# Altium schematic sheet mcu_support.SchDoc
size A3; SheetNumber: 4; SheetTotal: 5
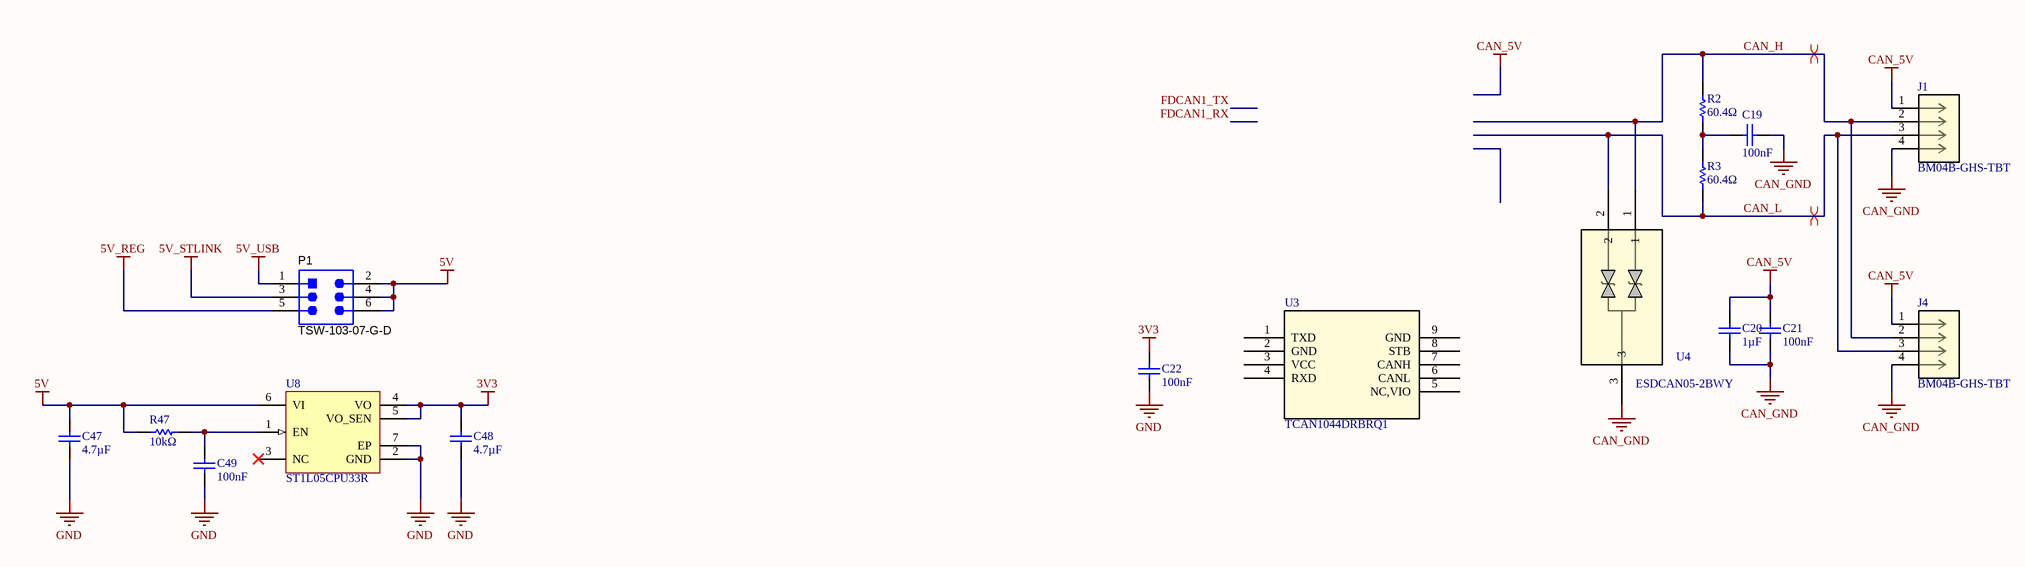
[diagram p0: mcu_support.SchDoc]

## Parts
C19  value 100nF  [C0603]  (hidden comment: CC0603KRX7R8BB104)
C20  value 1µF  [C0603]  (hidden comment: CC0603KRX7R7BB105)
C21  value 100nF  [C0603]  (hidden comment: CC0603KRX7R8BB104)
C22  value 100nF  [C0603]  (hidden comment: CC0603KRX7R8BB104)
C47  value 4.7µF  [C0603]  (hidden comment: CC0603KRX5R7BB475)
C48  value 4.7µF  [C0603]  (hidden comment: CC0603KRX5R7BB475)
C49  value 100nF  [C0603]  (hidden comment: CC0603KRX7R8BB104)
J1  BM04B-GHS-TBT  [CONN_BM04B-GHS-TBT_JST]
J4  BM04B-GHS-TBT  [CONN_BM04B-GHS-TBT_JST]
P1  TSW-103-07-G-D  [SMTC-TSW-103-07-G-D_V]
R2  value 60.4Ω  [RESC1608X55X25ML10T15]  (hidden comment: RC0603FR-0760R4L)
R3  value 60.4Ω  [RESC1608X55X25ML10T15]  (hidden comment: RC0603FR-0760R4L)
R47  value 10kΩ  [RESC1608X55X25ML10T15]  (hidden comment: RC0603FR-0710KL)
U3  TCAN1044DRBRQ1  [SON_4DRBRQ1_TEX]
U4  ESDCAN05-2BWY  [SOT323-3L_STM]
U8  ST1L05CPU33R  [DFN6D_L]

## Nets
3V3: C22.2 C48.2 U8.4(VO) U8.5(VO_SEN)
5V: C47.2 P1.2 P1.4 P1.6 R47.1 U8.6(VI)
5V_REG: P1.5
5V_STLINK: P1.3
5V_USB: P1.1
CAN_5V: C20.2 C21.2 J1.1 J4.1
CAN_GND: C19.1 C20.1 C21.1 J1.4 J4.4 U4.3
GND: C22.1 C47.1 C48.1 C49.1 U8.2(GND) U8.7(EP)
CAN_H: J1.2 J4.2 R2.2 U4.1
CAN_L: J1.3 J4.3 R3.1 U4.2
NetC19_2: C19.2 R2.1 R3.2
NetC49_2: C49.2 R47.2 U8.1(EN)

Not connected (* = marked no-connect by the designer): U3 1(TXD) 2(GND) 3(VCC) 4(RXD) 5(NC,VIO) 6(CANL) 7(CANH) 8(STB) 9(GND); U8 3(NC)*

## Layout directives
differential pair: CAN_H, CAN_L

## Library data of the parts
C19 C21 C22 C49 = CMP-00179-1: 25V 100nF X7R ±10% 0603 Multilayer Ceramic Capacitors MLCC - SMD/SMT ROHS; Length: 1.6mm; Pins: 2; Case/Package: 0603; Composition: Ceramic; Lead Free: Lead Free; Lifecycle Status: Production; RoHS: Compliant; China RoHS: Compliant; Number of Terminals: 2; Max Operating Temperature: 125°C; Tolerance: 10%; Width: 800µm; Dielectric Material: Ceramic; Voltage Rating (DC): 25V; Depth: 800µm; Min Operating Temperature: -55°C; Halogen Free: Halogen Free; Mounting Technology: Surface Mount; Material: Ceramic; REACH SVHC: Yes; Case Code (Imperial): 0603; Height: 800µm; Schedule B: 8532240020, 8532240020; Voltage Rating: 25V; Thickness: 889µm; Termination: SMD/SMT; Dielectric: X7R; Radiation Hardening: No; Voltage: 25V; Case Code (Metric): 1608
C20 = CMP-00211-1: 16V 1uF X7R ±10% 0603 Multilayer Ceramic Capacitors MLCC - SMD/SMT ROHS; Dissipation Factor: 5%; Harmonized Tariff Schedule (HTS) Code: 8532.24.00.20; Width: 800µm; Country of Origin: Mainland China, Taiwan; Case Code (Imperial): 0603; Schedule B: 8532240020, 8532240020; Halogen Free: Halogen Free; Lifecycle Status: Production; China RoHS: Compliant; Max Operating Temperature: 125°C; Export Control Classification Number (ECCN) Code: EAR99; Min Operating Temperature: -55°C; Radiation Hardening: No; Dielectric Material: Ceramic; Voltage: 16V; RoHS: Compliant; Voltage Rating (DC): 16V; Termination: SMD/SMT; Material: Ceramic; Mounting Technology: Surface Mount; Case Code (Metric): 1608; Case/Package: 0603; Depth: 800µm; Voltage Rating: 16V; Dielectric: X7R; Thickness: 889µm; Lead Free: Lead Free; Length: 1.6mm; REACH SVHC: Yes; Height: 800µm; Introduction Date: 2009-04-17; Tolerance: 10%; Composition: Ceramic; Number of Terminals: 2; Pins: 2
C47 C48 = CMP-00273-1: 16V 4.7uF X5R ±10% 0603 Multilayer Ceramic Capacitors MLCC - SMD/SMT ROHS; Halogen Free: Halogen Free; Depth: 800µm; Case/Package: 0603; China RoHS: Compliant; REACH SVHC: Yes; Height: 800µm; Harmonized Tariff Schedule (HTS) Code: 8532.24.00.20; Width: 800µm; Export Control Classification Number (ECCN) Code: EAR99; Voltage Rating (DC): 16V; Number of Terminals: 2; Country of Origin: Mainland China, Taiwan; Thickness: 939.8µm; Material: Ceramic; Introduction Date: 2013-02-05; RoHS: Compliant; Dielectric: X5R; Voltage Rating: 16V; Max Operating Temperature: 85°C; Case Code (Imperial): 0603; Mounting Technology: Surface Mount; Composition: Ceramic; Min Operating Temperature: -55°C; Length: 1.6mm; Tolerance: 10%; Lead Free: Lead Free; Lifecycle Status: Production; Schedule B: 8532240020, 8532240020; Dielectric Material: Ceramic; Termination: SMD/SMT; Case Code (Metric): 1608; Weight: 2.012816mg
J1 J4 = CMP-189-000000-2: Description; Manufacturer_Name: JST; Source: BM04B-GHS-TBT.SchLib; Copyright: Copyright (C) 2026 Ultra Librarian. All rights reserved.; Design Item ID: BM04B-GHS-TBT; Type: Type; Manufacturer_Part_Number: BM04B-GHS-TBT; RefDes: RefDes
P1 = CMP-014-000047-1: CONN HEADER VERT 6POS 2.54MM / Connector Header Through Hole 6 position 0.100" (2.54mm); Manufacturer Lifecycle Status: PRODUCTION; Max Voltage Rating (AC): 550V; Number of Contacts: 6; Connector Type: Male Pin; Gender: Male; Max Current Rating: 7.6A; Orientation: Straight; Width: 5.08mm; Pins: 6; Row Spacing: 2.54mm; Termination: Solder; REACH SVHC: No; Mounting Technology: Through Hole; Lead Pitch: 2.54mm; Number of Positions: 6; Lead Free: Lead Free; Number of Rows: 2; Min Operating Temperature: -55°C; Pitch: 2.54mm; Packaging: Bulk; Housing Color: Black; Contact Mating Length: 5.842mm; Contact Material: Bronze; RoHS: Compliant; Radiation Hardening: No; Color: Black; Depth: 5.08mm; Max Operating Temperature: 125°C; Lifecycle Status: Production; Contact Plating: Gold; Housing Material: Polyester
R2 R3 = CMP-RES-00051-1: Res Thick Film 0603 60.4 Ohm 1% 0.1W(1/10W) ±100ppm/C Pad SMD T/R; Working Voltage: 75V; Temperature Coefficient: 100ppm/°C; Power Dissipation: 100mW; Voltage Rating (DC): 50V; Introduction Date: 2004-09-22; Number of Terminals: 2; Harmonized Tariff Schedule (HTS) Code: 8533.21.00.30; Export Control Classification Number (ECCN) Code: EAR99; Height: 450µm; Width: 800µm; Tolerance: 1%; Case/Package: 0603; Lifecycle Status: Production; Packaging: Tape & Reel; Depth: 800µm; Power Rating: 100mW; RoHS: Compliant; Voltage Rating: 75V; REACH SVHC: Yes; Schedule B: 8533210045, 8533210045; China RoHS: Non-Compliant; Min Operating Temperature: -55°C; Country of Origin: Mainland China, Taiwan; Composition: Thick Film; Termination: SMD/SMT; Case Code (Imperial): 0603; Length: 1.6mm; Lead Free: Lead Free; Military Standard: Not; Max Operating Temperature: 155°C; Mounting Technology: Surface Mount
R47 = CMP-RES-00040-1: 10 kOhms ±1% 0.1W, 1/10W Chip Resistor 0603 (1608 Metric) Moisture Resistant Thick Film; Tolerance: 1%; Case/Package: 0603
U3 = CMP-157-000000-1: Automotive high-speed CAN transceiver 8-SON -40 to 125; Manufacturer_Name: Texas Instruments; Type: Type; RefDes: RefDes; Source: TCAN1044DRBRQ1.SchLib; Copyright: Copyright (C) 2025 Ultra Librarian. All rights reserved.; Datasheet: https://www.ti.com/lit/gpn/tcan1044-q1; Design Item ID: TCAN1044DRBRQ1; Manufacturer_Part_Number: TCAN1044DRBRQ1
U4 = CMP-002-000046-1: Automotive dual-line TVS in SOT323-3L for CAN bus (24 V system); Manufacturer_Name: STMicroelectronics; Design Item ID: ESDCAN05-2BWY; Source: ESDCAN05-2BWY.SchLib; Manufacturer_Part_Number: ESDCAN05-2BWY; Type: Type; RefDes: RefDes; Copyright: Copyright (C) 2025 Ultra Librarian. All rights reserved.
U8 = CMP-015-000054-1: ST1L05 Series 1.3 A 3.3 V Fixed Output LDO BICMOS Voltage Regulator - DFN-6; Number of Circuits: 1; Min Output Voltage: 3.3V; Polarity: Positive; Output Voltage Accuracy: 2%; Min Input Voltage: 3V; Dropout Voltage: 300mV; Voltage Tolerance: 2.5%; Output Current: 1.3A; Max Supply Voltage: 5.5V; Quiescent Current: 500µA; Max Junction Temperature (Tj): 125°C; China RoHS: Compliant; Lead Free: Lead Free; Introduction Date: 2008-02-29; Harmonized Tariff Schedule (HTS) Code: 8542.39.00.60; Output Type: Fixed; Export Control Classification Number (ECCN) Code: EAR99; Max Operating Temperature: 125°C; RoHS: Compliant; Length: 3mm; Case/Package: DFN; Min Current Limit: 1.3A; Accuracy: 2%; Min Operating Temperature: 0°C; REACH SVHC: Yes; Height - Seated (Max): 1mm; Pins: 6; Radiation Hardening: No; Number of Terminals: 6; Schedule B: 8542390000, 8542390000; Packaging: Cut Tape (CT); Mounting Technology: Surface Mount; Number of Channels: 1; Number of Regulators: 1; Output Voltage: 3.3V; Width: 3mm; Country of Origin: Malaysia; Number of Outputs: 1; Terminal Pitch: 950µm; Lifecycle Status: Production; Max Output current: 1.3A